# Altium schematic sheet power_filter.SchDoc
size A; SheetNumber: 2; SheetTotal: 13
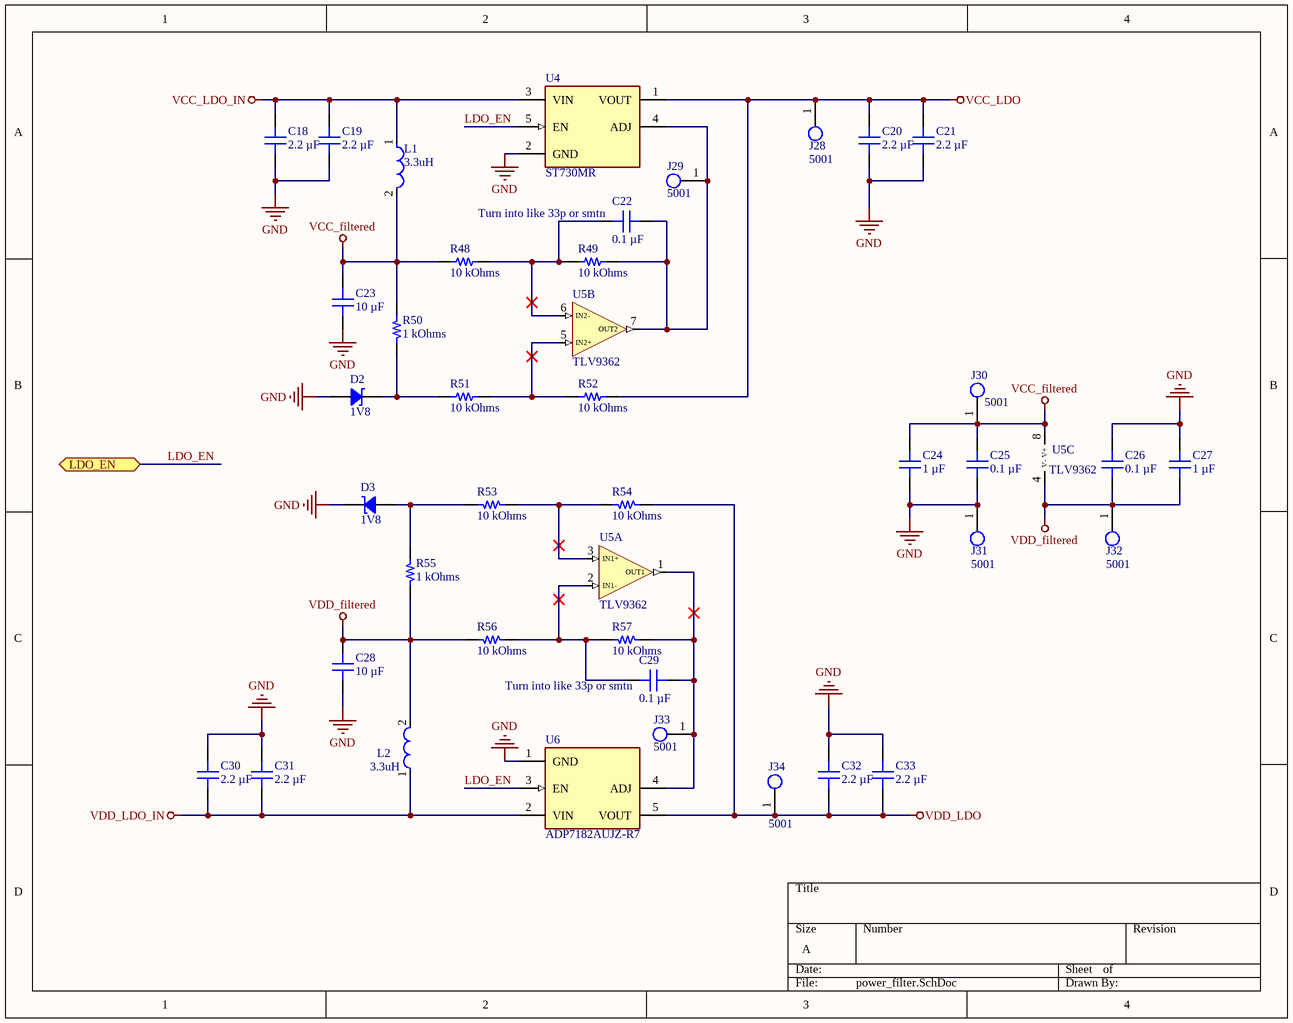
[diagram p0: power_filter.SchDoc]

## Parts
C18  2.2 µF  [CAP 1206_3216 - 0.8MM]
C19  2.2 µF  [CAP 1206_3216 - 0.8MM]
C20  2.2 µF  [CAP 1206_3216 - 0.8MM]
C21  2.2 µF  [CAP 1206_3216 - 0.8MM]
C22  0.1 µF  [CAP 1206_3216 - 0.8MM]
C23  10 µF  [CAP 1206_3216 - 0.8MM]
C24  1 µF  [CAP 1206_3216 - 0.8MM]
C25  0.1 µF  [CAP 1206_3216 - 0.8MM]
C26  0.1 µF  [CAP 1206_3216 - 0.8MM]
C27  1 µF  [CAP 1206_3216 - 0.8MM]
C28  10 µF  [CAP 1206_3216 - 0.8MM]
C29  0.1 µF  [CAP 1206_3216 - 0.8MM]
C30  2.2 µF  [CAP 1206_3216 - 0.8MM]
C31  2.2 µF  [CAP 1206_3216 - 0.8MM]
C32  2.2 µF  [CAP 1206_3216 - 0.8MM]
C33  2.2 µF  [CAP 1206_3216 - 0.8MM]
D2  1V8  [SOD323]
D3  1V8  [SOD323]
J28  5001  [FP-5001-MFG]
J29  5001  [FP-5001-MFG]
J30  5001  [FP-5001-MFG]
J31  5001  [FP-5001-MFG]
J32  5001  [FP-5001-MFG]
J33  5001  [FP-5001-MFG]
J34  5001  [FP-5001-MFG]
L1  3.3uH  [FP-MLZ2012-1_25-IPC_B]
L2  3.3uH  [FP-MLZ2012-1_25-IPC_B]
R48  10 kOhms  [YAGEO RES 1206_3216]
R49  10 kOhms  [YAGEO RES 1206_3216]
R50  1 kOhms  [YAGEO RES 1206_3216]
R51  10 kOhms  [YAGEO RES 1206_3216]
R52  10 kOhms  [YAGEO RES 1206_3216]
R53  10 kOhms  [YAGEO RES 1206_3216]
R54  10 kOhms  [YAGEO RES 1206_3216]
R55  1 kOhms  [YAGEO RES 1206_3216]
R56  10 kOhms  [YAGEO RES 1206_3216]
R57  10 kOhms  [YAGEO RES 1206_3216]
U4  ST730MR  [FP-UJ-5-IPC_B]
U5  TLV9362  [SOIC8-127P600X175-8N]  (parts A,B,C of 3)
U6  ADP7182AUJZ-R7  [FP-UJ-5-IPC_B]

## Ports
LDO_EN (bidir, see main[3C], MCU[4B], power[2C])

## Nets
GND: C18.1 C19.1 C20.1 C21.1 C23.1 C24.1 C25.1 C26.2 C27.2 C28.1 C30.1 C31.1 C32.1 C33.1 D2.1 D3.2 J31.1 U4.2(GND) U6.1(GND)
VCC_filtered: C23.2 C24.2 C25.2 J30.1 L1.2 R48.2 R50.1 U5.8(V+)
VCC_LDO: C20.2 C21.2 J28.1 R52.1 U4.1(VOUT)
VCC_LDO_IN: C18.2 C19.2 L1.1 U4.3(VIN)
VDD_filtered: C26.1 C27.1 C28.2 J32.1 L2.2 R55.2 R56.2 U5.4(V-)
VDD_LDO: C32.2 C33.2 J34.1 R54.1 U6.5(VOUT)
VDD_LDO_IN: C30.2 C31.2 L2.1 U6.2(VIN)
LDO_EN: U4.5(EN) U6.3(EN) ; port LDO_EN
NetC22_1: C22.1 J29.1 R49.1 U4.4(ADJ) U5.7(OUT2)
NetC22_2: C22.2 R48.1 R49.2 U5.6(IN2-)
NetC29_1: C29.1 R56.1 R57.2 U5.2(IN1-)
NetC29_2: C29.2 J33.1 R57.1 U5.1(OUT1) U6.4(ADJ)
NetD2_2: D2.2 R50.2 R51.2
NetD3_1: D3.1 R53.2 R55.1
NetR51_1: R51.1 R52.2 U5.5(IN2+)
NetR53_1: R53.1 R54.2 U5.3(IN1+)

## Notes on the sheet
- (near C22) Turn into like 33p or smtn
- (near C29) Turn into like 33p or smtn

## Library data of the parts
C18-C21 C30-C33 = 885382208001: CAP CER 2.2UF 25V X7R 1206; manufacturer: Würth Elektronik; Tolerance: ±10%; Part Number: 885382208001; Capacitance: 2.2 µF; Applications: Boardflex Sensitive; componentlink2description: DigiKey Link; componentlink2url: https://www.digikey.com/en/products/detail/würth-elektronik/885382208001/9816354; Device Package: 1206 (3216 Metric); Features: Soft Termination; lastupdated: 6/4/2024 19:10:38; Lifecycle Status: Active; Minimum Order: 1; Mounting Type: Surface Mount, MLCC; Operating Temperature: -55°C ~ 125°C; Package / Case: 1206 (3216 Metric); packaging: TapeAndReel; partid: 45904; Part Status: Active; price: 0.35; series: WCAP-CSST; Size / Dimension: 0.126" L x 0.063" W (3.20mm x 1.60mm); Supplier 1: DigiKey; Supplier Part Number 1: 732-13199-1-ND; Temperature Coefficient: X7R; Thickness (Max): 0.083" (2.10mm); value: 2.2 µF; Voltage - Rated: 25V
C22 C25 C26 C29 = 885012208087: CAP CER 0.1UF 50V X7R 1206; manufacturer: Würth Elektronik; Tolerance: ±10%; Part Number: 885012208087; Capacitance: 0.1 µF; Applications: General Purpose; componentlink1description: Datasheet; componentlink1url: https://katalog.we-online.de/pbs/datasheet/885012208087.pdf; componentlink2description: DigiKey Link; componentlink2url: https://www.digikey.com/en/products/detail/würth-elektronik/885012208087/5453982; Device Package: 1206 (3216 Metric); lastupdated: 6/4/2024 19:10:27; Lifecycle Status: Active; Minimum Order: 1; Mounting Type: Surface Mount, MLCC; Operating Temperature: -55°C ~ 125°C; Package / Case: 1206 (3216 Metric); packaging: TapeAndReel; partid: 20879; Part Status: Active; price: 0.06; series: WCAP-CSGP; Size / Dimension: 0.126" L x 0.063" W (3.20mm x 1.60mm); Supplier 1: DigiKey; Supplier Part Number 1: 732-8127-1-ND; Temperature Coefficient: X7R; Thickness (Max): 0.035" (0.90mm); value: 0.1 µF; Voltage - Rated: 50V
C23 C28 = 885012208069: CAP CER 10UF 25V X7R 1206; manufacturer: Würth Elektronik; Tolerance: ±10%; Part Number: 885012208069; Capacitance: 10 µF; Applications: General Purpose; componentlink1description: Datasheet; componentlink1url: https://katalog.we-online.de/pbs/datasheet/885012208069.pdf; componentlink2description: DigiKey Link; componentlink2url: https://www.digikey.com/en/products/detail/würth-elektronik/885012208069/5453429; Device Package: 1206 (3216 Metric); lastupdated: 6/4/2024 19:10:32; Lifecycle Status: Active; Minimum Order: 1; Mounting Type: Surface Mount, MLCC; Operating Temperature: -55°C ~ 125°C; Package / Case: 1206 (3216 Metric); packaging: TapeAndReel; partid: 43199; Part Status: Active; price: 0.40; series: WCAP-CSGP; Size / Dimension: 0.126" L x 0.063" W (3.20mm x 1.60mm); Supplier 1: DigiKey; Supplier Part Number 1: 732-7574-1-ND; Temperature Coefficient: X7R; Thickness (Max): 0.075" (1.90mm); value: 10 µF; Voltage - Rated: 25V
C24 C27 = 885012208093: CAP CER 1UF 50V X7R 1206; manufacturer: Würth Elektronik; Tolerance: ±10%; Part Number: 885012208093; Capacitance: 1 µF; Applications: General Purpose; componentlink1description: Datasheet; componentlink1url: https://katalog.we-online.de/pbs/datasheet/885012208093.pdf; componentlink2description: DigiKey Link; componentlink2url: https://www.digikey.com/en/products/detail/würth-elektronik/885012208093/5453432; Device Package: 1206 (3216 Metric); lastupdated: 6/4/2024 19:10:33; Lifecycle Status: Active; Minimum Order: 1; Mounting Type: Surface Mount, MLCC; Operating Temperature: -55°C ~ 125°C; Package / Case: 1206 (3216 Metric); packaging: TapeAndReel; partid: 39665; Part Status: Active; price: 0.10; series: WCAP-CSGP; Size / Dimension: 0.126" L x 0.063" W (3.20mm x 1.60mm); Supplier 1: DigiKey; Supplier Part Number 1: 732-7577-1-ND; Temperature Coefficient: X7R; Thickness (Max): 0.075" (1.90mm); value: 1 µF; Voltage - Rated: 50V
D2 D3 = BZX38450-C1V8X
J28-J34 = CMP-2000-05181-2: PC TEST POINT MINIATURE BLACK; Body Material: Bronze; Plating: Silver; Inside Diameter: 1.27mm; Hole Diameter: 1.6mm; Number of Ports: 1; Outside Diameter: 2.54mm; Insulation: Insulated; Insulation Material: Nylon; Mount: Through Hole; RoHS Compliant: Yes; Series: THM; Height: 0.3inch; Termination: Through Hole; Material: Nylon; Packaging: Bulk; Contact Material: Bronze; REACH SVHC: No SVHC; Contact Plating: Silver; Orientation: Straight; Lead Free: Lead Free; Package Quantity: 100; Length: 7.62mm; Flammability Rating: UL94 V-0; Number of Contacts: 1; Diameter: 2.54mm; Housing Color: Black; Color: Black
L1 L2 = MLZ2012M: Shielded Multilayer Inductor 3.3uH ±20% 500mA 260mΩ SMD 0805; Saturation Current: 350mA; Core Material: Ferrite; DC Resistance (DCR): 260mR; RoHS Compliant: Yes; Mount: Surface Mount; Case Code (Metric): 2012; Case/Package: 0805; Min Operating Temperature: -55°C; Package Quantity: 2000; Shielding: Shielded; Current Rating: 500mA; Height - Seated (Max): 0.057inch; Case Code (Imperial): 0805; Width: 0.049inch; Tolerance: 20%; Packaging: Tape and Reel; Inductance: 3.3uH; Lead Free: Lead Free; Max Operating Temperature: 125°C; Length: 0.079inch; Value: 3.3uH
R48 R49 R51-R54 R56 R57 = RT1206FRE0710KL: RES SMD 10K OHM 1% 1/4W 1206; Manufacturer: Yageo; Power (Watts): 0.25W, 1/4W; Temperature Coefficient: ±50ppm/°C; Part Number: RT1206FRE0710KL; ComponentLink1Description: Datasheet; ComponentLink1URL: https://www.yageo.com/upload/media/product/productsearch/datasheet/rchip/PYu-RT_1-to-0.01_RoHS_L_11.pdf; ComponentLink2Description: DigiKey Link; ComponentLink2URL: https://www.digikey.com/en/products/detail/yageo/RT1206FRE0710KL/1082868; Composition: Thin Film; Device Package: 1206 (3216 Metric); Height - Seated (Max): 0.026" (0.65mm); LastUpdated: 7/25/2024 09:21:28; Lifecycle Status: Active; Minimum Order: 1; Number of Terminations: 2; Operating Temperature: -55°C ~ 155°C; Package / Case: 1206 (3216 Metric); Packaging: TapeAndReel; PartId: 38903; Part Status: Active; Price: 0.01; Resistance: 10 kOhms; Series: RT; Size / Dimension: 0.122" L x 0.063" W (3.10mm x 1.60mm); Supplier 1: DigiKey; Supplier Part Number 1: YAG1242CT-ND; Supplier Device Package: 1206; Tolerance: ±1%; Value: 10 kOhms
R50 R55 = RT1206FRE071KL: RES SMD 1K OHM 1% 1/4W 1206; Manufacturer: Yageo; Power (Watts): 0.25W, 1/4W; Temperature Coefficient: ±50ppm/°C; Part Number: RT1206FRE071KL; ComponentLink1Description: Datasheet; ComponentLink1URL: https://www.yageo.com/upload/media/product/productsearch/datasheet/rchip/PYu-RT_1-to-0.01_RoHS_L_11.pdf; ComponentLink2Description: DigiKey Link; ComponentLink2URL: https://www.digikey.com/en/products/detail/yageo/RT1206FRE071KL/1083016; Composition: Thin Film; Device Package: 1206 (3216 Metric); Height - Seated (Max): 0.026" (0.65mm); LastUpdated: 7/25/2024 09:21:27; Lifecycle Status: Active; Minimum Order: 1; Number of Terminations: 2; Operating Temperature: -55°C ~ 155°C; Package / Case: 1206 (3216 Metric); Packaging: TapeAndReel; PartId: 40465; Part Status: Active; Price: 0.01; Resistance: 1 kOhms; Series: RT; Size / Dimension: 0.122" L x 0.063" W (3.10mm x 1.60mm); Supplier 1: DigiKey; Supplier Part Number 1: YAG3366CT-ND; Supplier Device Package: 1206; Tolerance: ±1%; Value: 1 kOhms
U5 = TLV9362: TLV936x 10-MHz, 40-V, RRO, Operational Amplifie; ComponentLink1Description: Datasheet; ComponentLink1URL: https://www.ti.com/lit/ds/symlink/tlv9362.pdf
U6 = ADP7182: IC REG LIN NEG ADJ 200MA 5TSOT; Manufacturer: Analog Devices; Number Of Outputs: 1; Min Supply Voltage: -2.7V; Max Junction Temp: +125°C; Dropout Voltage: -185mV; Output Current: -200mA; Max Supply Voltage: -28V; Output Voltage: -1.22/-27.815V; Nominal Supply Current: -33/-650uA; Output Type: AdjustableProgrammable; Accuracy Percentage: 1%; RoHS: TRUE; Ambient Temperature Range Low: -40°C; Digikey Description: IC REG LIN NEG ADJ 200MA 5TSOT; Device Class L3: Voltage Regulators - Linear; Ambient Temperature Range High: +85°C; Manufacturer Part Number: ADP7182AUJZ-R7; ComponentLink2URL: https://www.analog.com/media/en/technical-documentation/data-sheets/ADP7182.pdf; Ipc Land Pattern Name: SOT95P280X100-5; Temperature Range Low: -40°C; ComponentLink2Description: Datasheet; Mouser Description: LDO Regulator Neg -1.22V to -27V 0.2A 5-Pin TSOT T/R; Category: IC; Automotive: No; Device Class L1: Integrated Circuits (ICs); Temperature: -40°C to +125°C; Octopart: https://octopart.com/adp7182aujz-r7-analog+devices-21054665; Device Class L2: Power Management ICs; Height: 1mm; Package: UJ-5; Temperature Range High: +125°C; Lead Free: Yes